# EasyEDA schematic Trix-Loco-PCB.json
TITLE: TRIX-Loco-Shield Analog; REV: 1.0; Date: 2026-05-20; Sheet: 1/1; Drawn By: helmut-f; Company: ECH
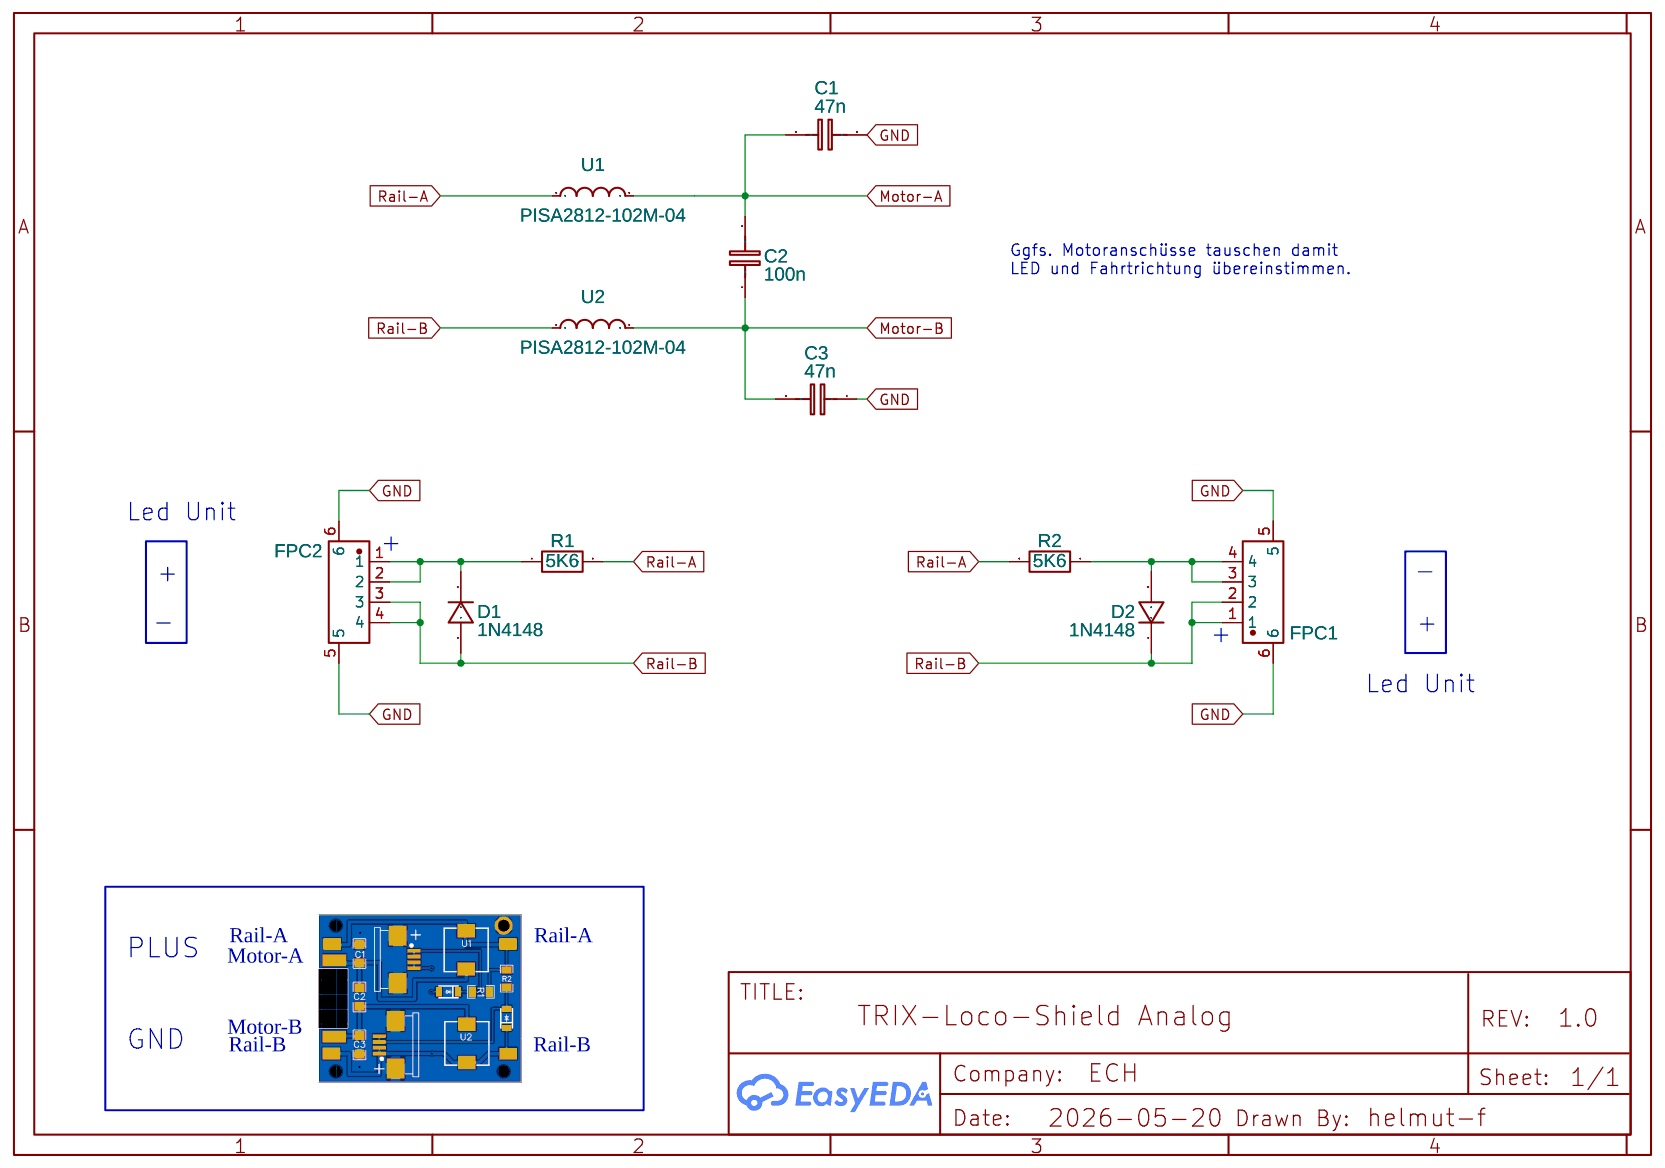
[diagram p0: schematic sheet]

## Parts
C1  47n  [C1206]
C2  100n  [C1206]
C3  47n  [C1206]
D1  1N4148  [SOD-80C_L3.3-W1.5-RD]
D2  1N4148  [SOD-80C_L3.3-W1.5-RD]
FPC1  FPC-4PIN-1.0MM-上接  [FPC-SMD_4P-P1.00_AFA07-S04ECC-00]
FPC2  FPC-4PIN-1.0MM-上接  [FPC-SMD_4P-P1.00_AFA07-S04ECC-00]
R1  5K6  [R1206]
R2  5K6  [R1206]
U1  PISA2812-102M-04  [IND-SMD_L7.5-W7.7]
U2  PISA2812-102M-04  [IND-SMD_L7.5-W7.7]

## Library data of the parts
C1-C3 = C_1206_EU: Contributor: LCEDA_Lib
D1 D2 = 1N4148: Supplier: LCSC; Manufacturer: SEMTECH; Supplier Part: C14516; Contributor: LCEDA_Lib
FPC1 FPC2 = FPC-4PIN-1.0MM-上接: Contributor: lcsc; Supplier: LCSC; Supplier Part: C9900018775; Manufacturer: null; JLCPCB Part Class: Extended Part
R1 R2 = R_1206_EU: Contributor: LCEDA_Lib
U1 U2 = PISA2812-102M-04: Supplier: LCSC; Supplier Part: C9900080779; Manufacturer: null; Contributor: lcsc

## Nets
GND: C1.2 C3.1 FPC1.5 FPC1.6 FPC2.5 FPC2.6
Motor-A: C1.1 C2.2 U1.2
Motor-B: C2.1 C3.2 U2.2
Rail-A: R1.2 R2.2 U1.1
Rail-B: D1.2(1) D2.1(2) FPC1.1 FPC1.2 FPC2.3 FPC2.4 U2.1
Net-(D1-1): D1.1(2) FPC2.1 FPC2.2 R1.1
Net-(D2-2): D2.2(1) FPC1.3 FPC1.4 R2.1

## Notes on the sheet
- Ggfs. Motoranschüsse tauschen damit
  LED und Fahrtrichtung übereinstimmen.
- Led Unit
- +
- +
- _
- _
- +
- +
- Led Unit
- Rail-A
- Rail-A
- PLUS
- Motor-A
- GND
- Motor-B
- Rail-B
- Rail-B
